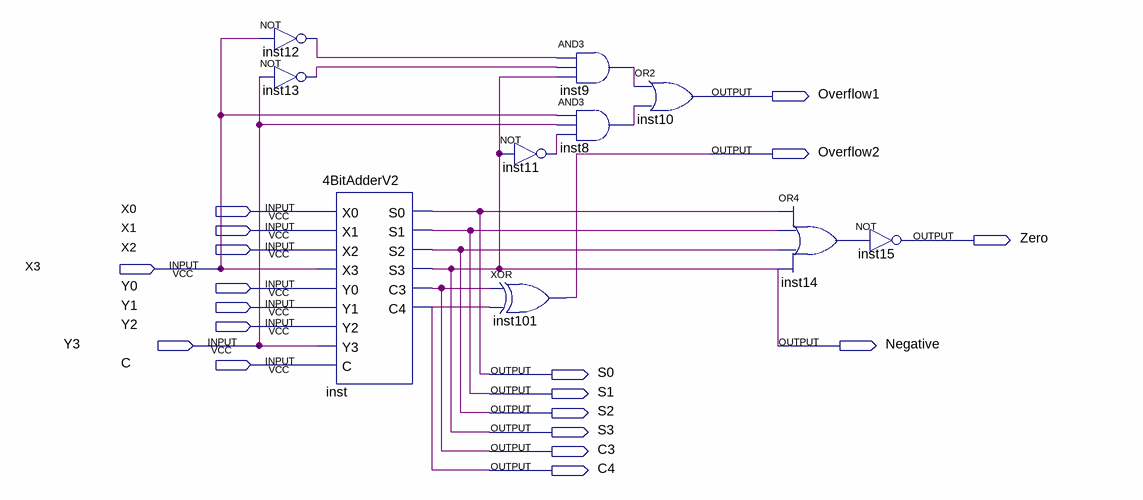
[diagram p0: schematic sheet]
// Quartus schematic 4BitAdderV2.bdf as structural Verilog: 10 symbols, 19 pins
module \4BitAdderV2  (
  input  X0,
  input  X1,
  input  X2,
  input  X3,
  input  Y0,
  input  Y1,
  input  Y2,
  input  Y3,
  input  C,
  output Overflow1,
  output Overflow2,
  output Zero,
  output Negative,
  output S0,
  output S1,
  output S2,
  output S3,
  output C3,
  output C4
);

  wire inst8_out, inst9_out, inst11_out, inst12_out, inst13_out, inst14_out;

  not inst12 (inst12_out, X3);
  not inst13 (inst13_out, Y3);
  \4BitAdderV2  inst (
    .X0(X0), .X1(X1), .X2(X2), .X3(X3), .Y0(Y0), .Y1(Y1), .Y2(Y2), .Y3(Y3), .C(C), .S0(S0), .S1(S1), .S2(S2),
    .S3(Negative), .C3(C3), .C4(C4));
  not inst11 (inst11_out, Negative);
  xor inst101 (Overflow2, C3, C4);
  and inst9 (inst9_out, inst12_out, inst13_out, Negative);
  and inst8 (inst8_out, X3, Y3, inst11_out);
  or inst10 (Overflow1, inst9_out, inst8_out);
  or inst14 (inst14_out, S0, S1, S2, Negative);
  not inst15 (Zero, inst14_out);

  assign S3 = Negative;
endmodule
